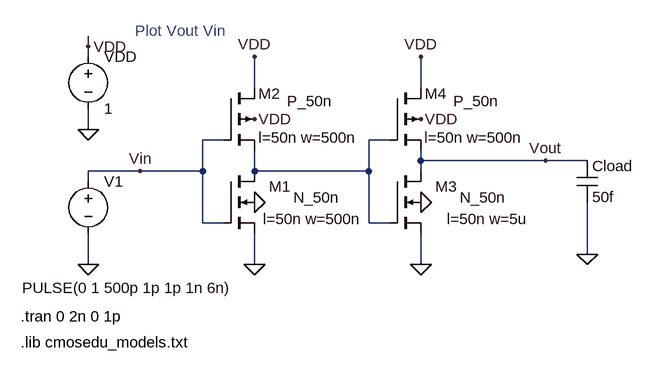
[diagram p0: schematic Fig13_30.asc]
Fig13_30.asc, the LTspice schematic file:
Version 4
SHEET 1 3172 680
WIRE 192 -368 192 -384
WIRE 192 -352 192 -368
WIRE 192 -240 192 -272
WIRE 192 -160 192 -176
WIRE 192 -32 192 -80
WIRE 272 -176 192 -176
WIRE 368 -176 272 -176
WIRE 368 -176 368 -224
WIRE 368 -96 368 -176
WIRE 400 -224 368 -224
WIRE 400 -96 368 -96
WIRE 448 -304 448 -352
WIRE 448 -176 448 -208
WIRE 448 -32 448 -80
WIRE 624 -176 448 -176
WIRE 624 -176 624 -224
WIRE 624 -96 624 -176
WIRE 656 -224 624 -224
WIRE 656 -96 624 -96
WIRE 704 -304 704 -352
WIRE 704 -192 704 -208
WIRE 704 -176 704 -192
WIRE 704 -32 704 -80
WIRE 896 -192 704 -192
WIRE 960 -192 896 -192
WIRE 960 -48 960 -128
FLAG 448 -128 0
FLAG 192 -240 0
FLAG 192 -368 VDD
FLAG 448 -256 VDD
FLAG 448 -32 0
FLAG 448 -352 VDD
FLAG 704 -128 0
FLAG 704 -256 VDD
FLAG 704 -32 0
FLAG 704 -352 VDD
FLAG 960 -48 0
FLAG 192 -32 0
FLAG 896 -192 Vout
FLAG 272 -176 Vin
SYMBOL nmos4 400 -176 R0
WINDOW 0 104 24 Right 0
WINDOW 3 179 41 Right 0
WINDOW 123 213 74 Right 0
SYMATTR InstName M1
SYMATTR Value N_50n
SYMATTR Value2 l=50n w=500n
SYMBOL voltage 192 -368 R0
WINDOW 123 0 0 Left 0
WINDOW 39 0 0 Left 0
SYMATTR InstName VDD
SYMATTR Value 1
SYMBOL pmos4 400 -304 R0
WINDOW 0 88 9 Right 0
WINDOW 3 168 20 Right 0
WINDOW 123 206 76 Right 0
SYMATTR InstName M2
SYMATTR Value P_50n
SYMATTR Value2 l=50n w=500n
SYMBOL nmos4 656 -176 R0
WINDOW 0 104 24 Right 0
WINDOW 3 179 41 Right 0
WINDOW 123 213 74 Right 0
SYMATTR InstName M3
SYMATTR Value N_50n
SYMATTR Value2 l=50n w=5u
SYMBOL pmos4 656 -304 R0
WINDOW 0 88 9 Right 0
WINDOW 3 168 20 Right 0
WINDOW 123 206 76 Right 0
SYMATTR InstName M4
SYMATTR Value P_50n
SYMATTR Value2 l=50n w=500n
SYMBOL cap 944 -192 R0
SYMATTR InstName Cload
SYMATTR Value 50f
SYMBOL voltage 192 -176 R0
WINDOW 3 -102 180 Left 0
WINDOW 123 0 0 Left 0
WINDOW 39 0 0 Left 0
SYMATTR Value PULSE(0 1 500p 1p 1p 1n 6n)
SYMATTR InstName V1
TEXT 88 48 Left 0 !.tran 0 2n 0 1p
TEXT 88 88 Left 0 !.lib cmosedu_models.txt
TEXT 264 -392 Left 0 ;Plot Vout Vin

The netlist it stands for:
* Fig13_30.asc
M1 N001 Vin 0 0 N_50n l=50n w=500n
VDD VDD 0 1
M2 VDD Vin N001 VDD P_50n l=50n w=500n
M3 Vout N001 0 0 N_50n l=50n w=5u
M4 VDD N001 Vout VDD P_50n l=50n w=500n
Cload Vout 0 50f
V1 Vin 0 PULSE(0 1 500p 1p 1p 1n 6n)
.model NMOS NMOS
.model PMOS PMOS
.lib standard.mos
.tran 0 2n 0 1p
.lib cmosedu_models.txt
* Plot Vout Vin
.backanno
.end